# Altium schematic sheet Connectors.SchDoc
size A4
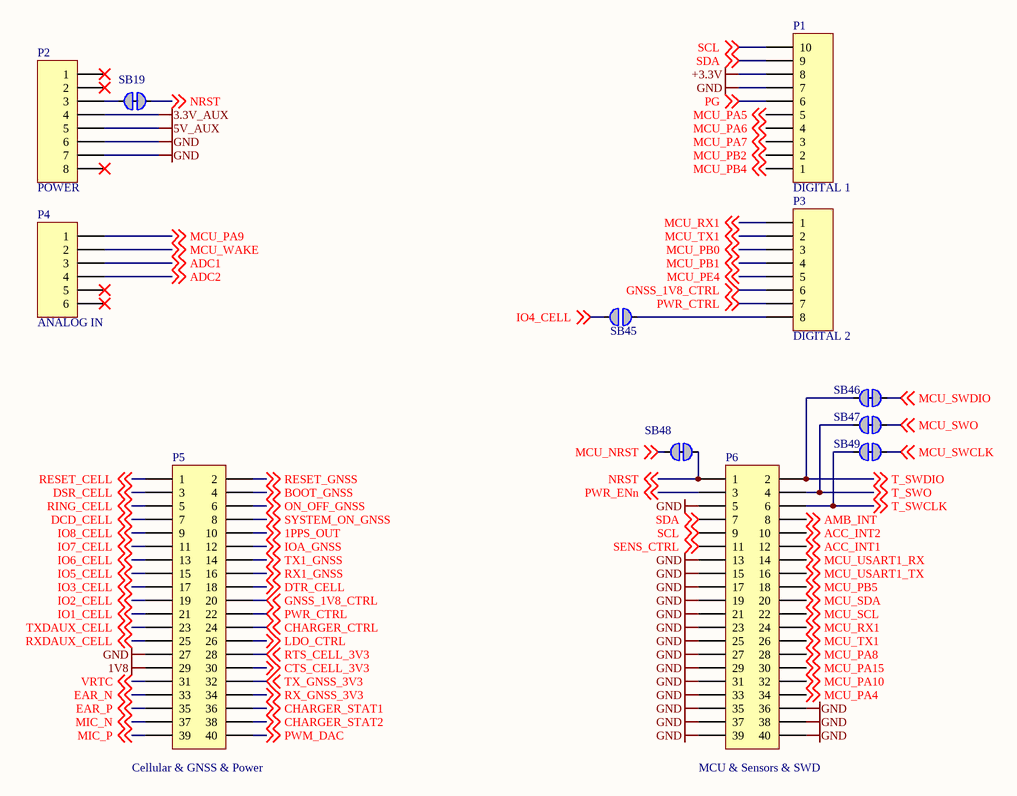
[diagram p0: Connectors.SchDoc]

## Parts
P1  DIGITAL 1  [HDR1X10]
P2  POWER  [HDR1X8]  (no BOM)
P3  DIGITAL 2  [HDR1X8]  (no BOM)
P4  ANALOG IN  [HDR1X6]  (no BOM)
P5  Cellular & GNSS & Power  [HDR2X20]  (no BOM)
P6  MCU & Sensors & SWD  [HDR2X20]  (no BOM)
SB19  Solderbridge  [Solderbridge_Shorted]  (value not drawn)  (net tie, no BOM)
SB45  Solderbridge  [Solderbridge]  (value not drawn)  (no BOM)
SB46  Solderbridge  [Solderbridge_Shorted]  (value not drawn)  (net tie, no BOM)
SB47  Solderbridge  [Solderbridge_Shorted]  (value not drawn)  (net tie, no BOM)
SB48  Solderbridge  [Solderbridge_Shorted]  (value not drawn)  (net tie, no BOM)
SB49  Solderbridge  [Solderbridge_Shorted]  (value not drawn)  (net tie, no BOM)

## Nets
1V8: P5.29
3.3V_AUX: P2.4
5V_AUX: P2.5
+3.3V: P1.8
GND: P1.7 P2.6 P2.7 P5.27 P6.5 P6.13 P6.15 P6.17 P6.19 P6.21 P6.23 P6.25 P6.27 P6.29 P6.31 P6.33 P6.35 P6.36 P6.37 P6.38 P6.39 P6.40
1PPS_OUT: P5.10 ; off-sheet 1PPS_OUT
ACC_INT1: P6.12 ; off-sheet ACC_INT1
ACC_INT2: P6.10 ; off-sheet ACC_INT2
ADC1: P4.3 ; off-sheet ADC1
ADC2: P4.4 ; off-sheet ADC2
AMB_INT: P6.8 ; off-sheet AMB_INT
BOOT_GNSS: P5.4 ; off-sheet BOOT_GNSS
CHARGER_CTRL: P5.24 ; off-sheet CHARGER_CTRL
CHARGER_STAT1: P5.36 ; off-sheet CHARGER_STAT1
CHARGER_STAT2: P5.38 ; off-sheet CHARGER_STAT2
CTS_CELL_3V3: P5.30 ; off-sheet CTS_CELL_3V3
DCD_CELL: P5.7 ; off-sheet DCD_CELL
DSR_CELL: P5.3 ; off-sheet DSR_CELL
DTR_CELL: P5.18 ; off-sheet DTR_CELL
EAR_N: P5.33 ; off-sheet EAR_N
EAR_P: P5.35 ; off-sheet EAR_P
GNSS_1V8_CTRL: P3.6 P5.20 ; off-sheet GNSS_1V8_CTRL
IO1_CELL: P5.21 ; off-sheet IO1_CELL
IO2_CELL: P5.19 ; off-sheet IO2_CELL
IO3_CELL: P5.17 ; off-sheet IO3_CELL
IO4_CELL: SB45.2 ; off-sheet IO4_CELL
IO5_CELL: P5.15 ; off-sheet IO5_CELL
IO6_CELL: P5.13 ; off-sheet IO6_CELL
IO7_CELL: P5.11 ; off-sheet IO7_CELL
IO8_CELL: P5.9 ; off-sheet IO8_CELL
IOA_GNSS: P5.12 ; off-sheet IOA_GNSS
LDO_CTRL: P5.26 ; off-sheet LDO_CTRL
MCU_NRST: SB48.1 ; off-sheet MCU_NRST
MCU_PA4: P6.34 ; off-sheet MCU_PA4
MCU_PA5: P1.5 ; off-sheet MCU_PA5
MCU_PA6: P1.4 ; off-sheet MCU_PA6
MCU_PA7: P1.3 ; off-sheet MCU_PA7
MCU_PA8: P6.28 ; off-sheet MCU_PA8
MCU_PA9: P4.1 ; off-sheet MCU_PA9
MCU_PA10: P6.32 ; off-sheet MCU_PA10
MCU_PA15: P6.30 ; off-sheet MCU_PA15
MCU_PB0: P3.3 ; off-sheet MCU_PB0
MCU_PB1: P3.4 ; off-sheet MCU_PB1
MCU_PB2: P1.2 ; off-sheet MCU_PB2
MCU_PB4: P1.1 ; off-sheet MCU_PB4
MCU_PB5: P6.18 ; off-sheet MCU_PB5
MCU_PE4: P3.5 ; off-sheet MCU_PE4
MCU_RX1: P3.1 P6.24 ; off-sheet MCU_RX1
MCU_SCL: P6.22 ; off-sheet MCU_SCL
MCU_SDA: P6.20 ; off-sheet MCU_SDA
MCU_SWCLK: SB49.2 ; off-sheet MCU_SWCLK
MCU_SWDIO: SB46.2 ; off-sheet MCU_SWDIO
MCU_SWO: SB47.2 ; off-sheet MCU_SWO
MCU_TX1: P3.2 P6.26 ; off-sheet MCU_TX1
MCU_USART1_RX: P6.14 ; off-sheet MCU_USART1_RX
MCU_USART1_TX: P6.16 ; off-sheet MCU_USART1_TX
MCU_WAKE: P4.2 ; off-sheet MCU_WAKE
MIC_N: P5.37 ; off-sheet MIC_N
MIC_P: P5.39 ; off-sheet MIC_P
NRST: P6.1 SB19.1 SB48.2 ; off-sheet NRST
ON_OFF_GNSS: P5.6 ; off-sheet ON_OFF_GNSS
PG: P1.6 ; off-sheet PG
PWM_DAC: P5.40 ; off-sheet PWM_DAC
PWR_CTRL: P3.7 P5.22 ; off-sheet PWR_CTRL
PWR_ENn: P6.3 ; off-sheet PWR_ENn
RESET_CELL: P5.1 ; off-sheet RESET_CELL
RESET_GNSS: P5.2 ; off-sheet RESET_GNSS
RING_CELL: P5.5 ; off-sheet RING_CELL
RTS_CELL_3V3: P5.28 ; off-sheet RTS_CELL_3V3
RX1_GNSS: P5.16 ; off-sheet RX1_GNSS
RX_GNSS_3V3: P5.34 ; off-sheet RX_GNSS_3V3
RXDAUX_CELL: P5.25 ; off-sheet RXDAUX_CELL
SCL: P1.10 P6.9 ; off-sheet SCL
SDA: P1.9 P6.7 ; off-sheet SDA
SENS_CTRL: P6.11 ; off-sheet SENS_CTRL
SYSTEM_ON_GNSS: P5.8 ; off-sheet SYSTEM_ON_GNSS
T_SWCLK: P6.6 SB49.1 ; off-sheet T_SWCLK
T_SWDIO: P6.2 SB46.1 ; off-sheet T_SWDIO
T_SWO: P6.4 SB47.1 ; off-sheet T_SWO
TX1_GNSS: P5.14 ; off-sheet TX1_GNSS
TX_GNSS_3V3: P5.32 ; off-sheet TX_GNSS_3V3
TXDAUX_CELL: P5.23 ; off-sheet TXDAUX_CELL
VRTC: P5.31 ; off-sheet VRTC
NetP2_3: P2.3 SB19.2
NetP3_8: P3.8 SB45.1

Not connected (* = marked no-connect by the designer): P2 1* 2* 8*; P4 5* 6*

## Library data of the parts
P1 = Header 10: Manufacturer: SparkFun Electronics; Manufacturer Part No.: PRT-11417; Part Description: Arduino Stackable Header Kit; Specification: 10 pins; Value: PRT-11417; Supplier: Digi-Key; Supplier part number: 1568-1413-ND
P2 P3 = Header 8: Part Description: Arduino Connector; Specification: 8 pins
P4 = Header 6: Part Description: Arduino Connector; Specification: 6 pins
P5 P6 = Header 20X2: Manufacturer: MPE-Garry; Manufacturer Part No.: 087-2-040-0-S-XS0-1260; Part Description: Typical Header; Specification: 40 pins, 2 rows, 2.54 mm pitch; Value: 087-2-040-0-S-XS0-1260; Supplier: Rutronik; Supplier part number: COREC36718; Link: https://www.rutronik24.com/product/mpegarry/087-2-040-0-s-xs0-1260/6123588.html
SB19 SB46-SB49 = Solderbridge Shorted: Manufacturer: *; Value: Solderbridge; Supplier: *; Supplier part number: *
SB45 = Solderbridge: Manufacturer: *; Value: Solderbridge; Supplier: *; Supplier part number: *